# Altium schematic sheet Byggern_Gruppe11_PCB_rev1.SchDoc
size A4
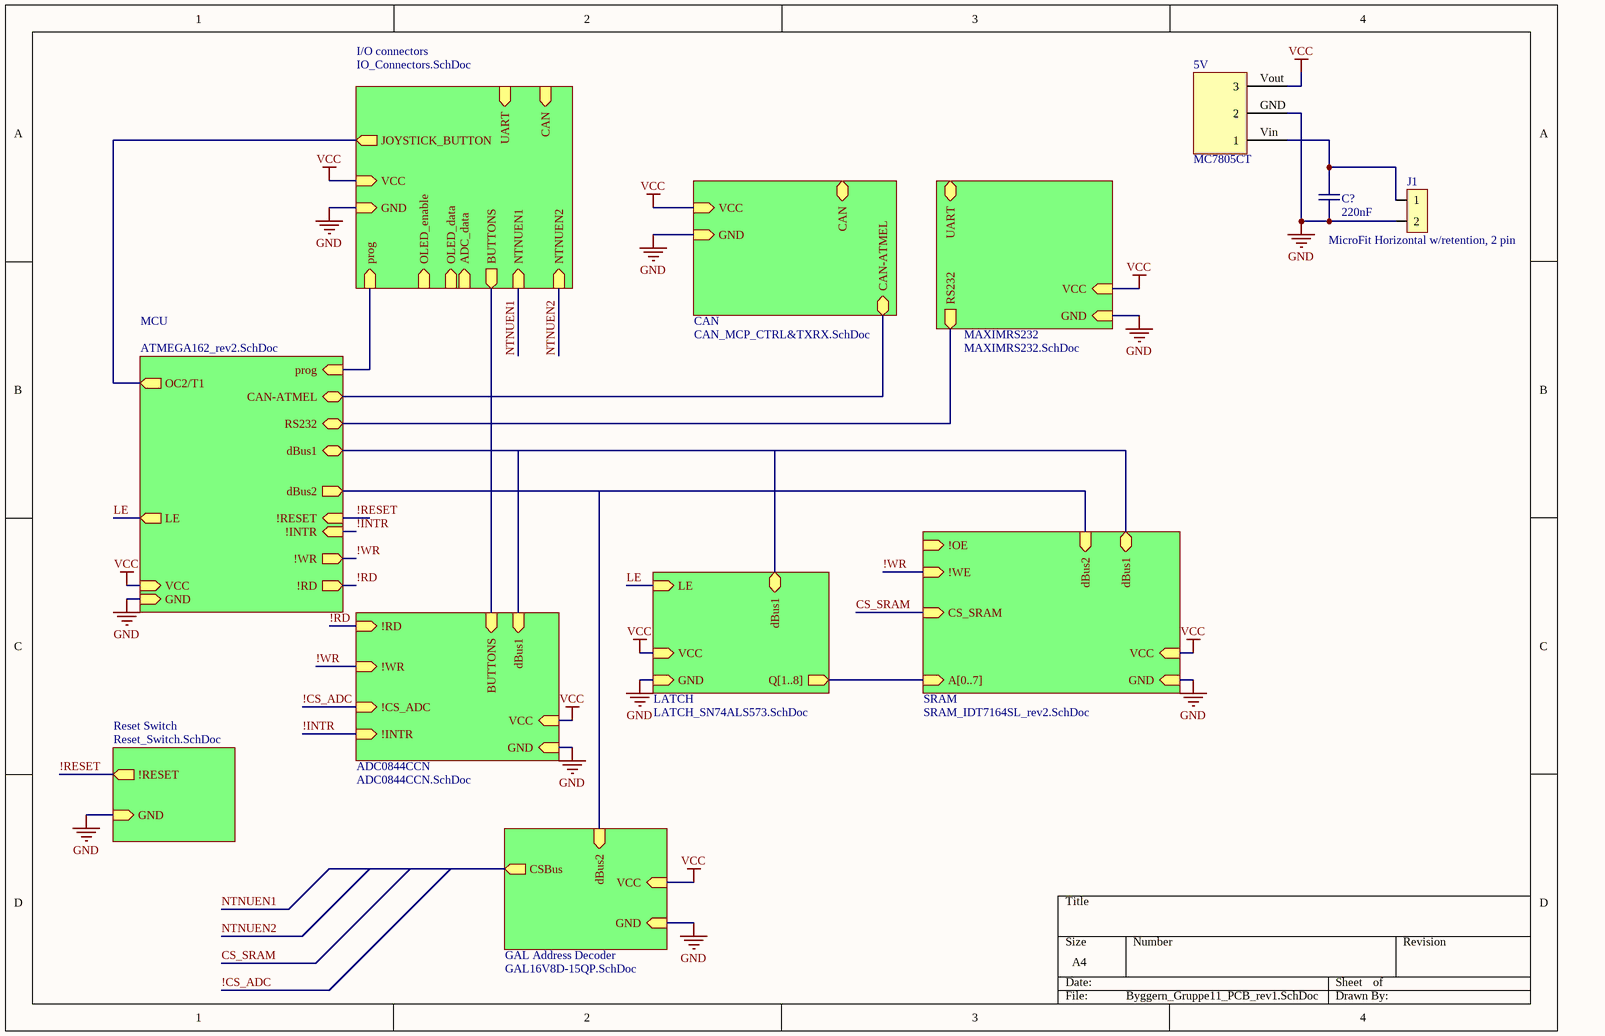
[diagram p0: Byggern_Gruppe11_PCB_rev1.SchDoc]

## Parts
5V  MC7805CT  [MC7805CT_5V]
C?  220nF  [CAPC0603(1608)55_N]
J1  MicroFit Horizontal w/retention, 2 pin  [PCBComponent]

## Sub-sheets
ADC0844CCN = ADC0844CCN.SchDoc: GND (in), !RD (in), dBus1 (in), !WR (in), !CS_ADC (in), VCC (in), !INTR (in), BUTTONS (in)
CAN = CAN_MCP_CTRL&TXRX.SchDoc: GND (in), VCC (in), CAN-ATMEL, CAN (bidir)
GAL Address Decoder = GAL16V8D-15QP.SchDoc: CSBus (out), dBus2 (in), GND (in), VCC (in)
I/O connectors = IO_Connectors.SchDoc: OLED_enable (in), CAN (in), VCC (in), prog (in), GND (in), OLED_data (in), ADC_data (in), UART (in), NTNUEN1 (in), NTNUEN2 (in), BUTTONS (out), JOYSTICK_BUTTON (out)
LATCH = LATCH_SN74ALS573.SchDoc: GND (in), dBus1 (bidir), VCC (in), Q[1..8] (out), LE (in)
MAXIMRS232 = MAXIMRS232.SchDoc: VCC (in), GND (in), RS232 (out), UART
MCU = ATMEGA162_rev2.SchDoc: dBus1 (bidir), VCC (in), GND (in), !RESET (in), !RD (out), dBus2 (out), prog (in), !INTR (in), !WR (out), CAN-ATMEL (bidir), OC2/T1 (out), RS232 (bidir), LE (out)
Reset Switch = Reset_Switch.SchDoc: !RESET (out), GND (in)
SRAM = SRAM_IDT7164SL_rev2.SchDoc: A[0..7] (in), dBus1 (bidir), !OE (in), dBus2 (in), !WE (in), VCC (in), GND (in), CS_SRAM (in)

## Nets
GND: 5V.GND(2) C?.1 J1.2 ; sheet MCU/GND, sheet LATCH/GND, sheet SRAM/GND, sheet CAN/GND, sheet Reset Switch/GND, sheet GAL Address Decoder/GND, sheet ADC0844CCN/GND, sheet MAXIMRS232/GND, sheet I/O connectors/GND
VCC: 5V.Vout(3) ; sheet MCU/VCC, sheet LATCH/VCC, sheet SRAM/VCC, sheet CAN/VCC, sheet GAL Address Decoder/VCC, sheet ADC0844CCN/VCC, sheet MAXIMRS232/VCC, sheet I/O connectors/VCC
!CS_ADC: sheet ADC0844CCN/!CS_ADC
!INTR: sheet MCU/!INTR, sheet ADC0844CCN/!INTR
!RD: sheet MCU/!RD, sheet ADC0844CCN/!RD
!RESET: sheet MCU/!RESET, sheet Reset Switch/!RESET
!WR: sheet MCU/!WR, sheet SRAM/!WE, sheet ADC0844CCN/!WR
CS_SRAM: sheet SRAM/CS_SRAM
LE: sheet MCU/LE, sheet LATCH/LE
NTNUEN1: sheet I/O connectors/NTNUEN1
NTNUEN2: sheet I/O connectors/NTNUEN2
Net5V_Vin: 5V.Vin(1) C?.2 J1.1
(unnamed): sheet MCU/OC2/T1, sheet I/O connectors/JOYSTICK_BUTTON

## Buses and harness runs
bus sheet ADC0844CCN/BUTTONS = sheet I/O connectors/BUTTONS
bus sheet ADC0844CCN/dBus1 = sheet LATCH/dBus1 = sheet MCU/dBus1 = sheet SRAM/dBus1
bus sheet CAN/CAN-ATMEL = sheet MCU/CAN-ATMEL
bus sheet GAL Address Decoder/dBus2 = sheet MCU/dBus2 = sheet SRAM/dBus2
bus sheet I/O connectors/prog = sheet MCU/prog
bus sheet LATCH/Q[1..8] = sheet SRAM/A[0..7]
bus sheet MAXIMRS232/RS232 = sheet MCU/RS232

## Library data of the parts
5V = MC7805CT: MC7805CT 5V Linear Regulator
C? = 3934: Capacitor; id: 3934; pakke_opprettet_av: 815; pris: 0; nokkelord: kondensator; pakketype: 0603; pakke_opprettet: 18.02.2015 14:18:13; symbol_opprettet_av: 815; symbol_opprettet: 14.11.2014 20:19:34; navn: 220nF
J1 = CMP-001-E66-5: micro-fit two pin horizontal dual row